# Altium schematic sheet DMIC_LED.SchDoc
size A
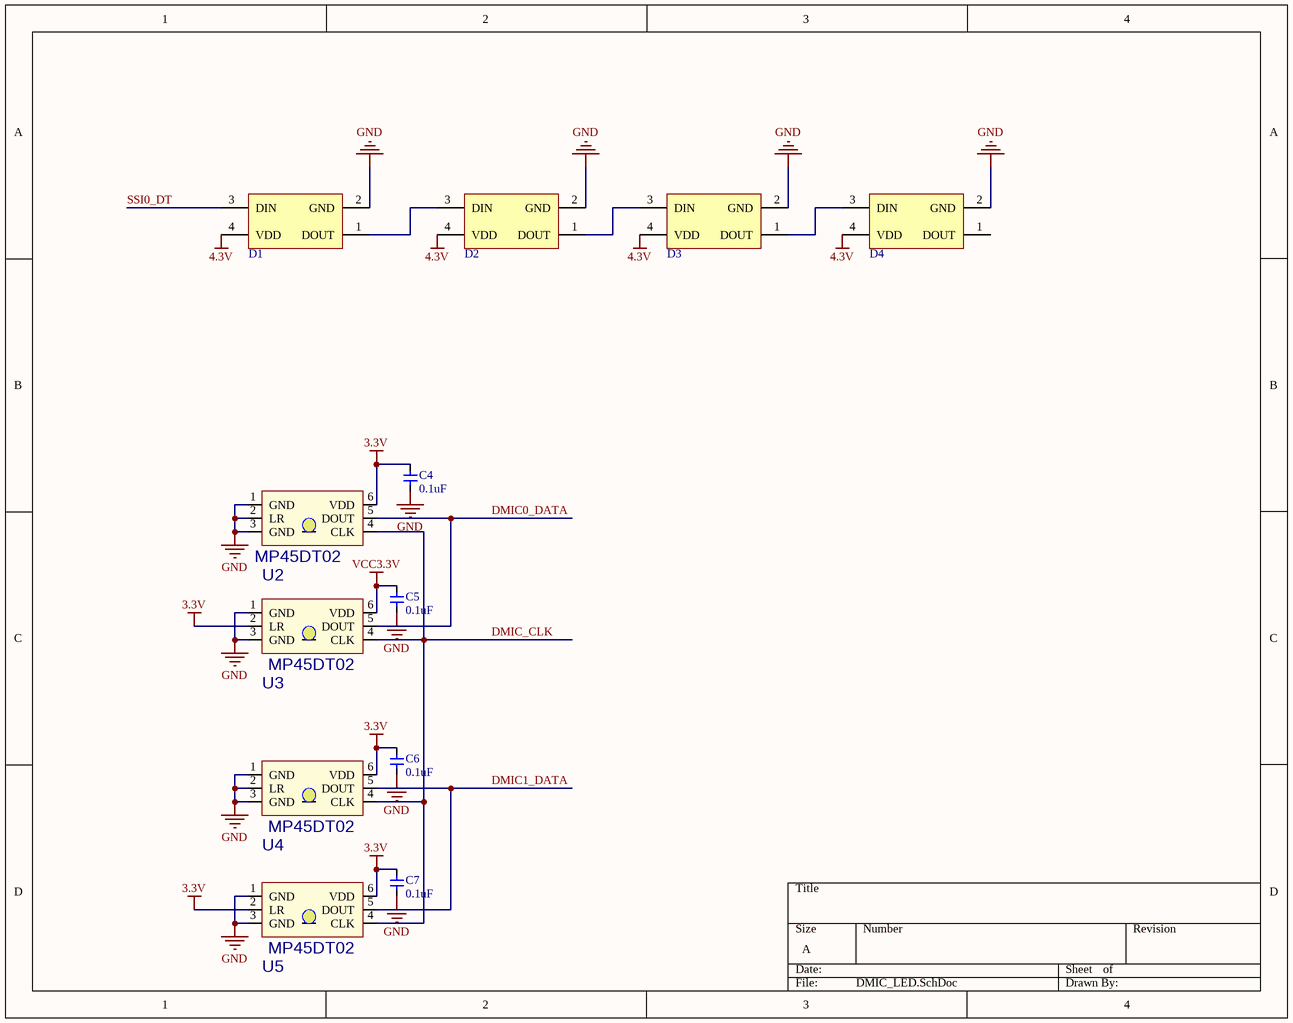
[diagram p0: DMIC_LED.SchDoc]

## Parts
C4  value 0.1uF  [CAP_0603]  (hidden comment: Cap_0603)
C5  value 0.1uF  [CAP_0603]  (hidden comment: Cap_0603)
C6  value 0.1uF  [CAP_0603]  (hidden comment: Cap_0603)
C7  value 0.1uF  [CAP_0603]  (hidden comment: Cap_0603)
D1  LED_3535_SK6812  [LED_3535_4P]  (value not drawn)
D2  LED_3535_SK6812  [LED_3535_4P]  (value not drawn)
D3  LED_3535_SK6812  [LED_3535_4P]  (value not drawn)
D4  LED_3535_SK6812  [LED_3535_4P]  (value not drawn)
U2  MP45DT02  [ST_HLGA6]
U3  MP45DT02  [ST_HLGA6]
U4  MP45DT02  [ST_HLGA6]
U5  MP45DT02  [ST_HLGA6]

## Nets
3.3V: C4.2 C6.2 C7.2 U2.6(VDD) U3.2(LR) U4.6(VDD) U5.2(LR) U5.6(VDD)
4.3V: D1.4(VDD) D2.4(VDD) D3.4(VDD) D4.4(VDD)
GND: C4.1 C5.1 C6.1 C7.1 D1.2(GND) D2.2(GND) D3.2(GND) D4.2(GND) U2.1(GND) U2.2(LR) U2.3(GND) U3.1(GND) U3.3(GND) U4.1(GND) U4.2(LR) U4.3(GND) U5.1(GND) U5.3(GND)
VCC3.3V: C5.2 U3.6(VDD)
DMIC0_DATA: U2.5(DOUT) U3.5(DOUT)
DMIC1_DATA: U4.5(DOUT) U5.5(DOUT)
DMIC_CLK: U2.4(CLK) U3.4(CLK) U4.4(CLK) U5.4(CLK)
SSI0_DT: D1.3(DIN)
NetD1_1: D1.1(DOUT) D2.3(DIN)
NetD2_1: D2.1(DOUT) D3.3(DIN)
NetD3_1: D3.1(DOUT) D4.3(DIN)

Not connected (* = marked no-connect by the designer): D4 1(DOUT)

## Library data of the parts
C4-C7 = Cap_0603: Capacitor
D1-D4 = LED_3535_SK6812: LED
U2-U5 = MP45DT02: Mic Omni-Directional -26dB 3.6V Rectangular Solder Pad; MF: STMicroelectronics; MP: MP45DT02; Package: None; Availability: Good; Price: 2.57 USD; Value: *